# Altium project US29080671(A).PrjPCB (part 8 of 10)

## Sheet MY_beamControl_R电平转换.SchDoc
size 419 x 281 mm
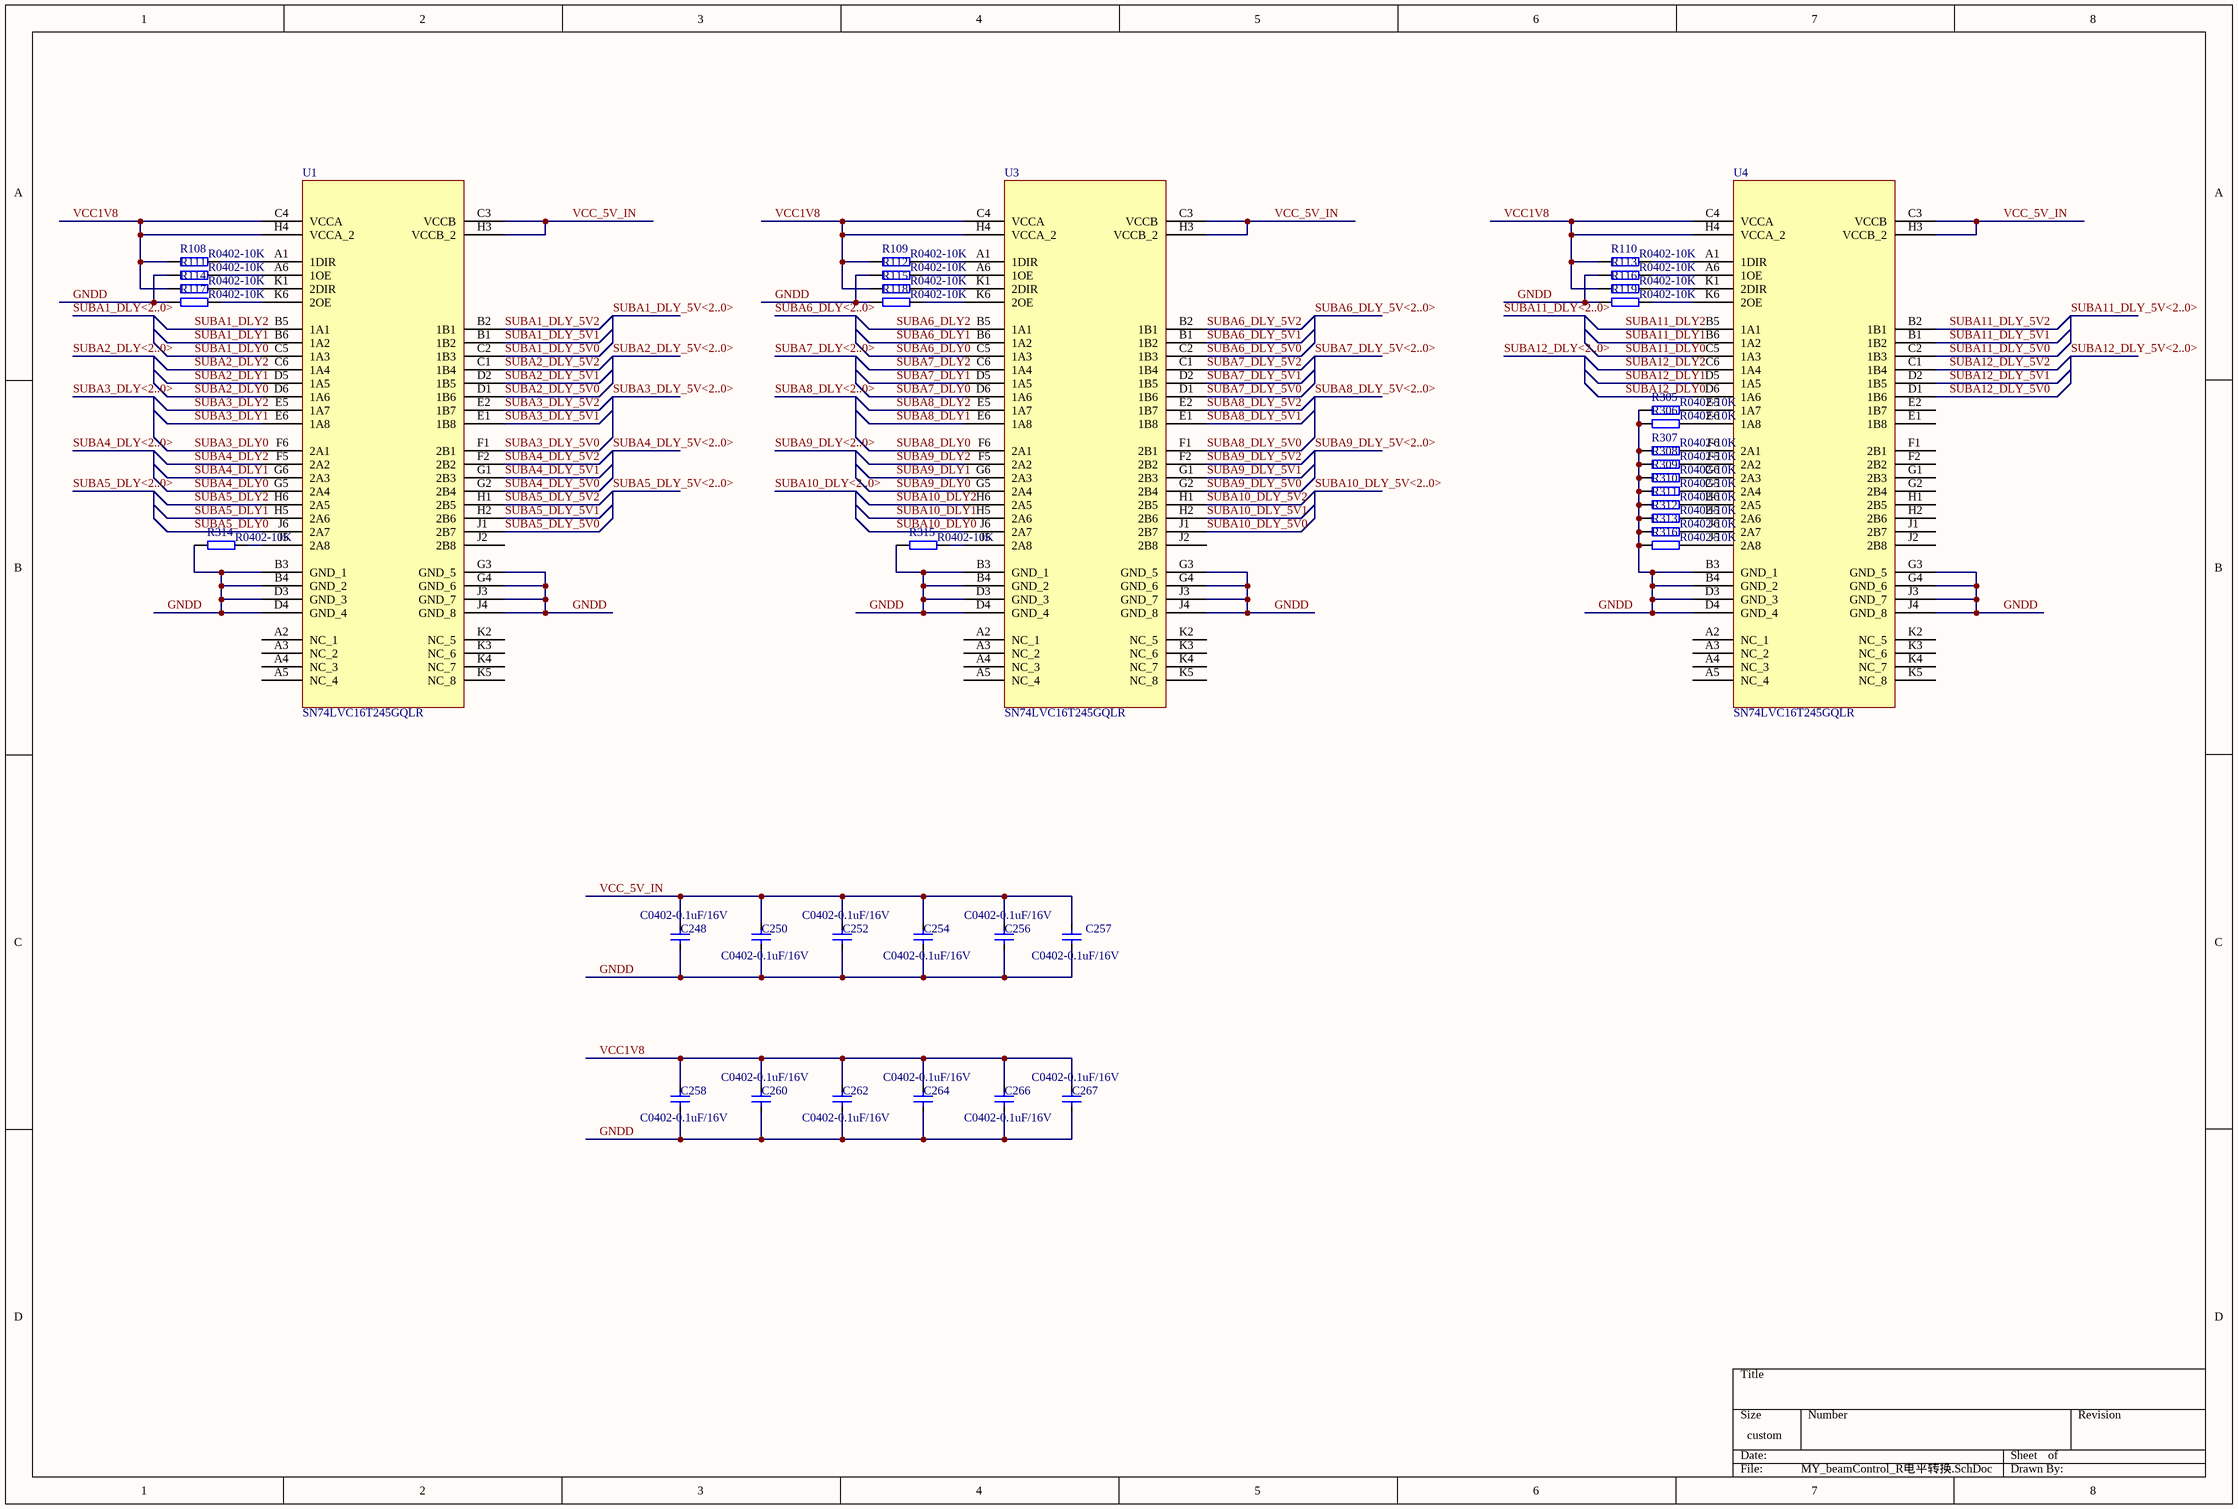
[diagram p41: MY_beamControl_R电平转换.SchDoc]

### Parts
C248  C0402-0.1uF/16V  [C0402]
C250  C0402-0.1uF/16V  [C0402]
C252  C0402-0.1uF/16V  [C0402]
C254  C0402-0.1uF/16V  [C0402]
C256  C0402-0.1uF/16V  [C0402]
C257  C0402-0.1uF/16V  [C0402]
C258  C0402-0.1uF/16V  [C0402]
C260  C0402-0.1uF/16V  [C0402]
C262  C0402-0.1uF/16V  [C0402]
C264  C0402-0.1uF/16V  [C0402]
C266  C0402-0.1uF/16V  [C0402]
C267  C0402-0.1uF/16V  [C0402]
R108  R0402-10K  [R0402]
R109  R0402-10K  [R0402]
R110  R0402-10K  [R0402]
R111  R0402-10K  [R0402]
R112  R0402-10K  [R0402]
R113  R0402-10K  [R0402]
R114  R0402-10K  [R0402]
R115  R0402-10K  [R0402]
R116  R0402-10K  [R0402]
R117  R0402-10K  [R0402]
R118  R0402-10K  [R0402]
R119  R0402-10K  [R0402]
R305  R0402-10K  [R0402]
R306  R0402-10K  [R0402]
R307  R0402-10K  [R0402]
R308  R0402-10K  [R0402]
R309  R0402-10K  [R0402]
R310  R0402-10K  [R0402]
R311  R0402-10K  [R0402]
R312  R0402-10K  [R0402]
R313  R0402-10K  [R0402]
R314  R0402-10K  [R0402]
R315  R0402-10K  [R0402]
R316  R0402-10K  [R0402]
U1  SN74LVC16T245GQLR  [BGA-56]
U3  SN74LVC16T245GQLR  [BGA-56]
U4  SN74LVC16T245GQLR  [BGA-56]

### Nets
GNDD: C248.2 C250.2 C252.2 C254.2 C256.2 C257.2 C258.2 C260.2 C262.2 C264.2 C266.2 C267.2 R111.1 R112.1 R113.1 R117.1 R118.1 R119.1 R305.1 R306.1 R307.1 R308.1 R309.1 R310.1 R311.1 R312.1 R313.1 R314.1 R315.1 R316.1 U1.B3(GND_1) U1.B4(GND_2) U1.D3(GND_3) U1.D4(GND_4) U1.G3(GND_5) U1.G4(GND_6) U1.J3(GND_7) U1.J4(GND_8) U3.B3(GND_1) U3.B4(GND_2) U3.D3(GND_3) U3.D4(GND_4) U3.G3(GND_5) U3.G4(GND_6) U3.J3(GND_7) U3.J4(GND_8) U4.B3(GND_1) U4.B4(GND_2) U4.D3(GND_3) U4.D4(GND_4) U4.G3(GND_5) U4.G4(GND_6) U4.J3(GND_7) U4.J4(GND_8)
VCC1V8: C258.1 C260.1 C262.1 C264.1 C266.1 C267.1 R108.1 R109.1 R110.1 R114.1 R115.1 R116.1 U1.C4(VCCA) U1.H4(VCCA_2) U3.C4(VCCA) U3.H4(VCCA_2) U4.C4(VCCA) U4.H4(VCCA_2)
SUBA1_DLY0: U1.C5(1A3)
SUBA1_DLY1: U1.B6(1A2)
SUBA1_DLY2: U1.B5(1A1)
SUBA1_DLY_5V0: U1.C2(1B3)
SUBA1_DLY_5V1: U1.B1(1B2)
SUBA1_DLY_5V2: U1.B2(1B1)
SUBA2_DLY0: U1.D6(1A6)
SUBA2_DLY1: U1.D5(1A5)
SUBA2_DLY2: U1.C6(1A4)
SUBA2_DLY_5V0: U1.D1(1B6)
SUBA2_DLY_5V1: U1.D2(1B5)
SUBA2_DLY_5V2: U1.C1(1B4)
SUBA3_DLY0: U1.F6(2A1)
SUBA3_DLY1: U1.E6(1A8)
SUBA3_DLY2: U1.E5(1A7)
SUBA3_DLY_5V0: U1.F1(2B1)
SUBA3_DLY_5V1: U1.E1(1B8)
SUBA3_DLY_5V2: U1.E2(1B7)
SUBA4_DLY0: U1.G5(2A4)
SUBA4_DLY1: U1.G6(2A3)
SUBA4_DLY2: U1.F5(2A2)
SUBA4_DLY_5V0: U1.G2(2B4)
SUBA4_DLY_5V1: U1.G1(2B3)
SUBA4_DLY_5V2: U1.F2(2B2)
SUBA5_DLY0: U1.J6(2A7)
SUBA5_DLY1: U1.H5(2A6)
SUBA5_DLY2: U1.H6(2A5)
SUBA5_DLY_5V0: U1.J1(2B7)
SUBA5_DLY_5V1: U1.H2(2B6)
SUBA5_DLY_5V2: U1.H1(2B5)
SUBA6_DLY0: U3.C5(1A3)
SUBA6_DLY1: U3.B6(1A2)
SUBA6_DLY2: U3.B5(1A1)
SUBA6_DLY_5V0: U3.C2(1B3)
SUBA6_DLY_5V1: U3.B1(1B2)
SUBA6_DLY_5V2: U3.B2(1B1)
SUBA7_DLY0: U3.D6(1A6)
SUBA7_DLY1: U3.D5(1A5)
SUBA7_DLY2: U3.C6(1A4)
SUBA7_DLY_5V0: U3.D1(1B6)
SUBA7_DLY_5V1: U3.D2(1B5)
SUBA7_DLY_5V2: U3.C1(1B4)
SUBA8_DLY0: U3.F6(2A1)
SUBA8_DLY1: U3.E6(1A8)
SUBA8_DLY2: U3.E5(1A7)
SUBA8_DLY_5V0: U3.F1(2B1)
SUBA8_DLY_5V1: U3.E1(1B8)
SUBA8_DLY_5V2: U3.E2(1B7)
SUBA9_DLY0: U3.G5(2A4)
SUBA9_DLY1: U3.G6(2A3)
SUBA9_DLY2: U3.F5(2A2)
SUBA9_DLY_5V0: U3.G2(2B4)
SUBA9_DLY_5V1: U3.G1(2B3)
SUBA9_DLY_5V2: U3.F2(2B2)
SUBA10_DLY0: U3.J6(2A7)
SUBA10_DLY1: U3.H5(2A6)
SUBA10_DLY2: U3.H6(2A5)
SUBA10_DLY_5V0: U3.J1(2B7)
SUBA10_DLY_5V1: U3.H2(2B6)
SUBA10_DLY_5V2: U3.H1(2B5)
SUBA11_DLY0: U4.C5(1A3)
SUBA11_DLY1: U4.B6(1A2)
SUBA11_DLY2: U4.B5(1A1)
SUBA11_DLY_5V0: U4.C2(1B3)
SUBA11_DLY_5V1: U4.B1(1B2)
SUBA11_DLY_5V2: U4.B2(1B1)
SUBA12_DLY0: U4.D6(1A6)
SUBA12_DLY1: U4.D5(1A5)
SUBA12_DLY2: U4.C6(1A4)
SUBA12_DLY_5V0: U4.D1(1B6)
SUBA12_DLY_5V1: U4.D2(1B5)
SUBA12_DLY_5V2: U4.C1(1B4)
VCC_5V_IN: C248.1 C250.1 C252.1 C254.1 C256.1 C257.1 U1.C3(VCCB) U1.H3(VCCB_2) U3.C3(VCCB) U3.H3(VCCB_2) U4.C3(VCCB) U4.H3(VCCB_2)
NetR108_2: R108.2 U1.A1(1DIR)
NetR109_2: R109.2 U3.A1(1DIR)
NetR110_2: R110.2 U4.A1(1DIR)
NetR111_2: R111.2 U1.A6(1OE)
NetR112_2: R112.2 U3.A6(1OE)
NetR113_2: R113.2 U4.A6(1OE)
NetR114_2: R114.2 U1.K1(2DIR)
NetR115_2: R115.2 U3.K1(2DIR)
NetR116_2: R116.2 U4.K1(2DIR)
NetR117_2: R117.2 U1.K6(2OE)
NetR118_2: R118.2 U3.K6(2OE)
NetR119_2: R119.2 U4.K6(2OE)
NetR305_2: R305.2 U4.E5(1A7)
NetR306_2: R306.2 U4.E6(1A8)
NetR307_2: R307.2 U4.F6(2A1)
NetR308_2: R308.2 U4.F5(2A2)
NetR309_2: R309.2 U4.G6(2A3)
NetR310_2: R310.2 U4.G5(2A4)
NetR311_2: R311.2 U4.H6(2A5)
NetR312_2: R312.2 U4.H5(2A6)
NetR313_2: R313.2 U4.J6(2A7)
NetR314_2: R314.2 U1.J5(2A8)
NetR315_2: R315.2 U3.J5(2A8)
NetR316_2: R316.2 U4.J5(2A8)

Not connected (* = marked no-connect by the designer): U1 A2(NC_1) A3(NC_2) A4(NC_3) A5(NC_4) J2(2B8) K2(NC_5) K3(NC_6) K4(NC_7) K5(NC_8); U3 A2(NC_1) A3(NC_2) A4(NC_3) A5(NC_4) J2(2B8) K2(NC_5) K3(NC_6) K4(NC_7) K5(NC_8); U4 A2(NC_1) A3(NC_2) A4(NC_3) A5(NC_4) E1(1B8) E2(1B7) F1(2B1) F2(2B2) G1(2B3) G2(2B4) H1(2B5) H2(2B6) J1(2B7) J2(2B8) K2(NC_5) K3(NC_6) K4(NC_7) K5(NC_8)

### Buses and harness runs
bus SUBA1_DLY<2..0>
bus SUBA1_DLY_5V<2..0>
bus SUBA2_DLY<2..0>
bus SUBA2_DLY_5V<2..0>
bus SUBA3_DLY<2..0>
bus SUBA3_DLY_5V<2..0>
bus SUBA4_DLY<2..0>
bus SUBA4_DLY_5V<2..0>
bus SUBA5_DLY<2..0>
bus SUBA5_DLY_5V<2..0>
bus SUBA6_DLY<2..0>
bus SUBA6_DLY_5V<2..0>
bus SUBA7_DLY<2..0>
bus SUBA7_DLY_5V<2..0>
bus SUBA8_DLY<2..0>
bus SUBA8_DLY_5V<2..0>
bus SUBA9_DLY<2..0>
bus SUBA9_DLY_5V<2..0>
bus SUBA10_DLY<2..0>
bus SUBA10_DLY_5V<2..0>
bus SUBA11_DLY<2..0>
bus SUBA11_DLY_5V<2..0>
bus SUBA12_DLY<2..0>
bus SUBA12_DLY_5V<2..0>

### Library data of the parts
C248 C250 C252 C254 C256-C258 C260 C262 C264 C266 C267 = C0402-0.1uF/16V: as C336 on sheet Z7_FUNCTION2; Part_number: C0402-0.1uF/16V; Part_type: CAP; Value: C0402-0.1uF/16V; temperature: -55℃\+125℃; Schematic_Part: CAP; PCB_Footprint: C0402; datasheet: #DataSheet\C_Samsung_General Capacitors.pdf#
R108-R119 R305-R316 = R0402-10K: Manufacturer: SAMSUNG; Part_number: R0402-10K; Part_type: RES; Value: R0402-10K; Schematic_Part: RES; PCB_Footprint: R0402
U1 U3 U4 = SN74LVC16T245: Part_number: SN74LVC16T245GQLR

## Sheet MY_beamControl_R_风扇供电接口.SchDoc
size A4
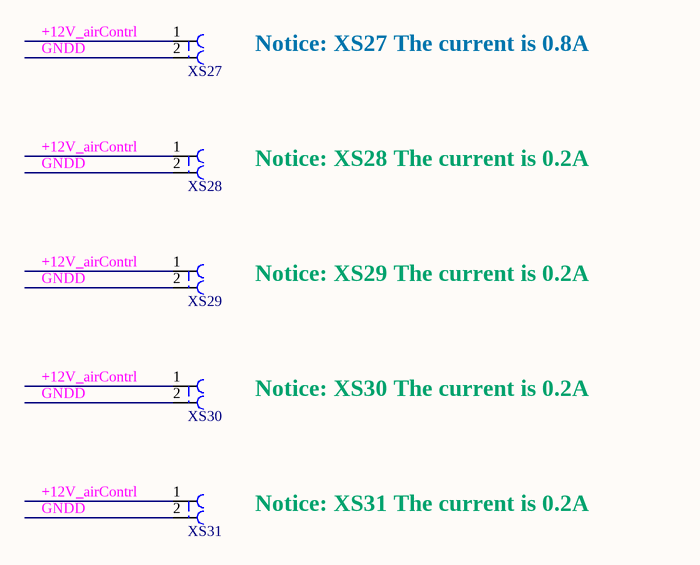
[diagram p42: MY_beamControl_R_风扇供电接口.SchDoc]

### Parts
XS27  PAD2_3mm/NC  [PAD2_3mm]  (value not drawn)
XS28  PAD2_2mm/NC  [PAD2_2mm]  (value not drawn)
XS29  PAD2_2mm/NC  [PAD2_2mm]  (value not drawn)
XS30  PAD2_2mm/NC  [PAD2_2mm]  (value not drawn)
XS31  PAD2_2mm/NC  [PAD2_2mm]  (value not drawn)

### Nets
GNDD: XS27.2 XS28.2 XS29.2 XS30.2 XS31.2
+12V_airContrl: XS27.1 XS28.1 XS29.1 XS30.1 XS31.1

### Notes on the sheet
- (near XS27) Notice: XS27 The current is 0.8A
- (near XS28) Notice: XS28 The current is 0.2A
- (near XS29) Notice: XS29 The current is 0.2A
- (near XS30) Notice: XS30 The current is 0.2A
- (near XS31) Notice: XS31 The current is 0.2A

### Library data of the parts
XS27-XS31 = 2PIN